# Altium schematic sheet Lipo-Charger-Sch.SchDoc
size A4; SheetNumber: 1; SheetTotal: 1
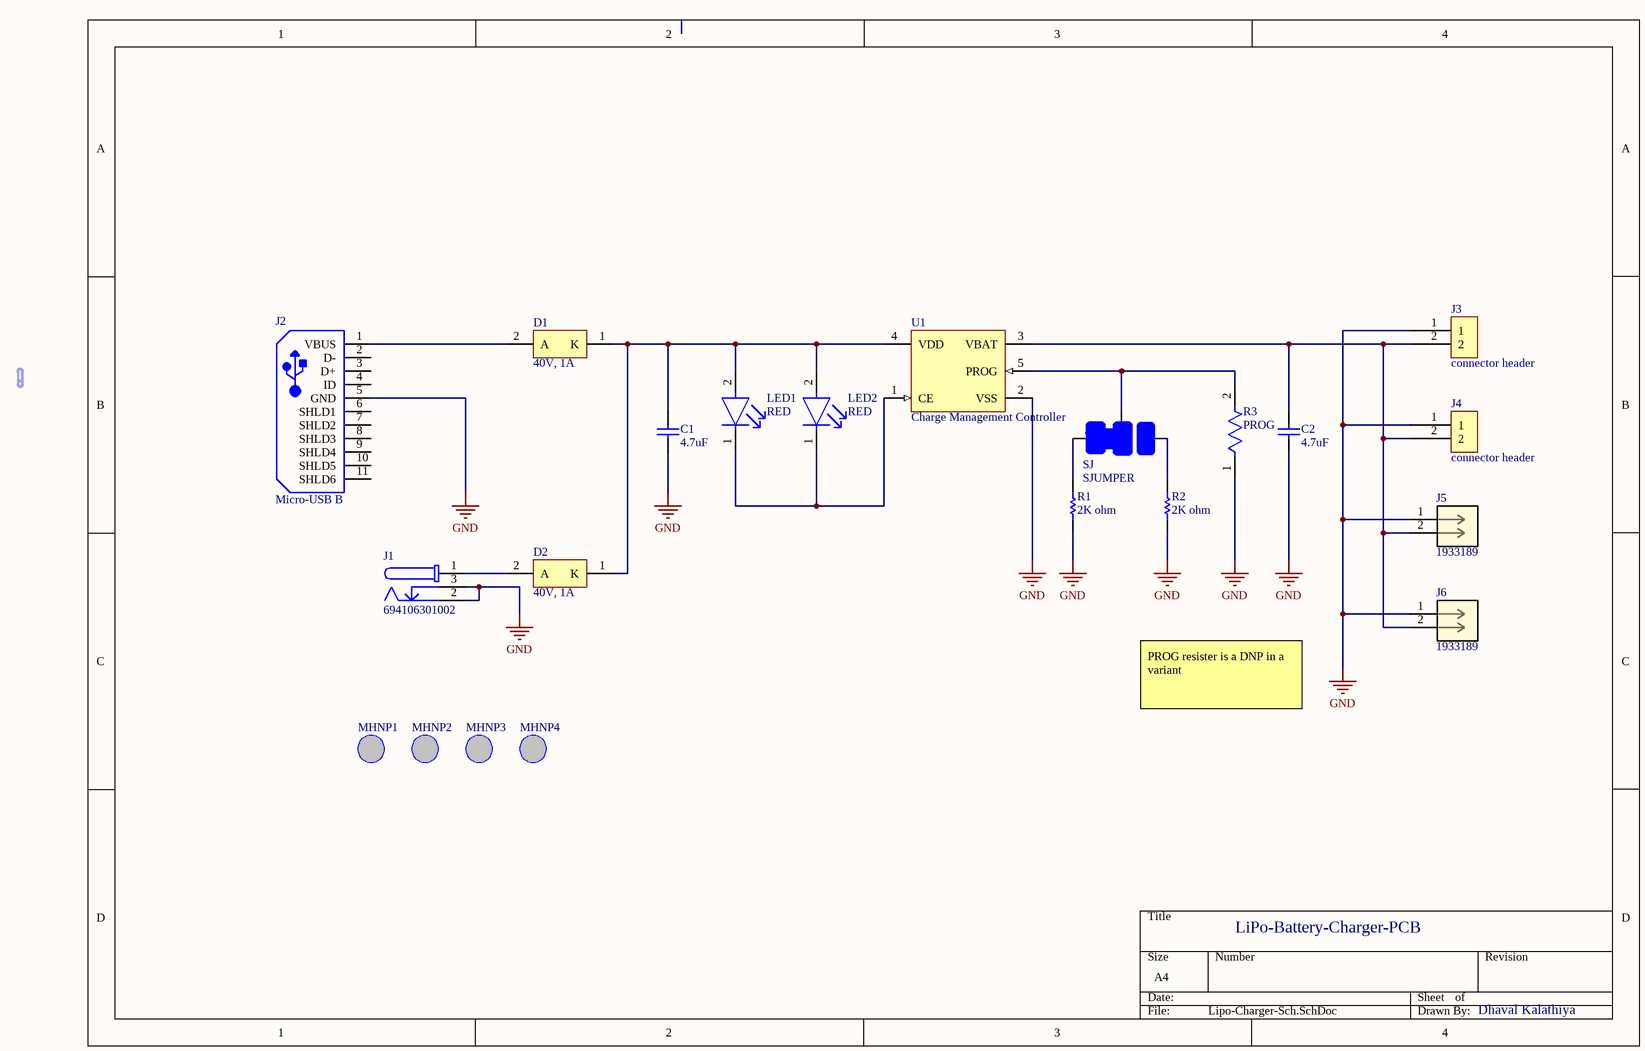
[diagram p0: Lipo-Charger-Sch.SchDoc]

## Parts
C1  4.7uF  [CAPC1206(3216)150_M]
C2  4.7uF  [CAPC1206(3216)150_M]
D1  40V, 1A  [ONSC-SMA-2-403D-02_V]
D2  40V, 1A  [ONSC-SMA-2-403D-02_V]
J1  694106301002  [694106301002]
J2  Micro-USB B  [USB-MICRO-B_V]
J3  connector header  [2-179276-2]
J4  connector header  [2-179276-2]
J5  1933189  [CONN02_1933189_PXC]
J6  1933189  [CONN02_1933189_PXC]
LED1  RED  [FP-SML-LX0603IW-TR-MFG]
LED2  RED  [FP-SML-LX0603IW-TR-MFG]
MHNP1  Mounting Hole Non-Plated 3.2mm  [MTHNP3P2]  (value not drawn)
MHNP2  Mounting Hole Non-Plated 3.2mm  [MTHNP3P2]  (value not drawn)
MHNP3  Mounting Hole Non-Plated 3.2mm  [MTHNP3P2]  (value not drawn)
MHNP4  Mounting Hole Non-Plated 3.2mm  [MTHNP3P2]  (value not drawn)
R1  2K ohm  [RESC2013X70X40LL20T20]
R2  2K ohm  [RESC2013X70X40LL20T20]
R3  PROG  [FP-CMF50-0]
SJ  SJUMPER  [SJUMPER-Footprint-1]
U1  Charge Management Controller  [SOT-23-OT5_M]

## Nets
GND: C1.1 C2.1 J1.2 J1.3 J2.5(GND) J3.1 J4.1 J5.1 J6.1 R1.1 R2.1 R3.1 U1.2(VSS)
NetC1_2: C1.2 D1.1(K) D2.1(K) LED1.2(A) LED2.2(A) U1.4(VDD)
NetC2_2: C2.2 J3.2 J4.2 J5.2 J6.2 U1.3(VBAT)
NetD1_2: D1.2(A) J2.1(VBUS)
NetD2_2: D2.2(A) J1.1
NetLED1_1: LED1.1(C) LED2.1(C) U1.1(CE)
NetR1_2: R1.2 SJ.1
NetR2_2: R2.2 SJ.3
NetR3_2: R3.2 SJ.2 U1.5(PROG)

Not connected (* = marked no-connect by the designer): J2 2(D-) 3(D+) 4(ID) 6(SHLD1) 7(SHLD2) 8(SHLD3) 9(SHLD4) 10(SHLD5) 11(SHLD6)

## Notes on the sheet
- PROG resister is a DNP in a variant
- LiPo-Battery-Charger-PCB
- Dhaval Kalathiya

## Library data of the parts
C1 C2 = CMP-1037-04894-1: Case-EIA: 1206; Rated Voltage: 6.3 V; Tolerance: Â±5%; Case-Metric: 3216; Value: 4.7uF; Technology: SMT; Max Thickness: 1.45 mm
D1 D2 = CMP-1055-00320-1: Schottky Power Rectifier, 2-Pin SMA, Pb-Free, Tape and Reel; PartNumber: MBRA140T3G; Manufacturer: On Semiconductor; Configuration: Single; IFSM Max (A): 30; PackageReference: SMA-2-403D-02; PackageDescription: 2-Pin Small Molded Package, J-Bend Lead, Body 2.605 x 4.315 mm; RoHS: TRUE; ComponentLink1Description: Manufacturer URL; Packing: Tape and Reel; ComponentLink3URL: http://www.onsemi.com/pub_link/Collateral/403D-02.PDF; ComponentLink2Description: Datasheet; ComponentLink2URL: http://www.onsemi.cn/pub_link/Collateral/MBRA140T3-D.PDF; DatasheetVersion: Rev. 10; ComponentLink1URL: http://www.onsemi.com/; ComponentLink3Description: Package Specification; Mounting Technology: Surface Mount; PackageVersion: Rev. G, 07/2012
J1 = CMP-1502-00188-2: NexarPartId: 52676100; Voltage Rating (DC): 20V; Gender: Male; Voltage Rating: 24V; Connector Type: Power; Insulation Resistance: 100MΩ; Current Rating: 5A; Shielding: Unshielded; Number of Contacts: 3; Color: Black; Housing Material: Polyamide; Contact Gender: Female; REACH SVHC: Unknown; Termination: Through Hole; Height: 11mm; RoHS: Compliant; Mount: Through Hole; Flammability Rating: UL94 V-0; Packaging: Bulk; Min Operating Temperature: -40°C; Contact Plating: Tin; Max Operating Temperature: 85°C; Operating Supply Voltage: 24V; Contact Material: Gold, Tin
J2 = CMP-2000-05827-1: Manufacturer: Molex; Featured Product: Micro-USBConnectorsUSBConnectors; Other Names: WM1399DKR; Package Version: Rev. F, 12/2012; Number of Contacts: 5; Connector Type: USB-microB; Catalog Drawings: 1050170001; 3D Model: 105017-0001.stp; Mating Products: WM17145-ND-CABLEMICROUSBBTOSTDA1.0MWM17147-ND-CABLEMICROUSBBTOSTDA2.0MWM17146-ND-CABLEMICROUSBBTOSTDA1.5M; PCN Assembly/Origin: ResinSupplier21/Oct/2015; Voltage - Max: 30V; Online Catalog: Molex-MicroUSB; Gender: Receptacle; Manufacturer URL: http://www.molex.com/; Package Description: 5-Leads USB, Micro B, Body 7.5 x 5 mm, Pitch 0.65 mm; Datasheet URL: http://www.molex.com/elqNow/elqRedir.htm?ref=http://www.molex.com/webdocs/datasheets/pdf/en-us/1050170001_IO_CONNECTORS.pdf; Ingress Protection: -; Datasheet Version: 03/2016; Mounting Type: BoardCutout,SurfaceMount,RightAngle; Circuits: 5; Standard Package: 1; Package Reference: MICRO-B; Package URL: http://www.molex.com/pdm_docs/sd/1050170001_sd.pdf; Category: Connectors,Interconnects; Series: -; RoHS Information: 1050170001CertofCompliance; Features: Shielded,SolderRetention; Family: USB,DVI,HDMIConnectors; Specifications: -; Packaging: Digi-Reel®; Mounting Technology: SurfaceMount
J3 J4 = 2-179276-2: Manufacture: TE; Supplier 1: Digikey; Supplier Part Number 1: A29548-ND; Manufacture part number: 2-179276-2
J5 J6 = 1933189: No Description Available; Mfr_Name: Phoenix Contact; RefDes: RefDes; Type: Type; ComponentLink1Description: New link; ComponentLink1URL: https://www.digikey.de/en/products/detail/phoenix-contact/1933189/568682
LED1 LED2 = CMP-57192-000012-1: LED RED DIFFUSED SMD; Luminous Intensity: 14mcd; Test Current: 20mA; Viewing Angle: 160°; Approvals: UL; Forward Voltage: 2V; Power Dissipation: 50mW; Dominant Wavelength: 635nm; Number of LEDs: 1; Lens Color: White; Height: 0.6mm; RoHS Compliant: Yes; Lead Free: Lead Free; Number of Pins: 2; Packaging: Tape and Reel; Case/Package: 0603; Length: 1.6mm; Color: Red; Max Operating Temperature: 85°C; Illumination Color: Red; Case Code (Metric): 1608; Diameter: 0.061inch; Min Operating Temperature: -25°C; Lens Style: Diffused; Mount: Surface Mount; Width: 0.8mm; Case Code (Imperial): 0603; Lens Transparency: Diffused; Wavelength: 635nm; Package Quantity: 1; Forward Current: 20mA
MHNP1-MHNP4 = MTHNP3P2
R1 R2 = CMP-2001-00483-1: Part Number: ERJ-P06J202V; Manufacturer: Panasonic
R3 = CMP-00030-44386654-1: Tolerance: 1%; Max Power Dissipation: 250mW; Voltage Rating: 200V; Power Rating: 125mW; Temperature Coefficient: 50ppm/°C; Resistance: 73.2kΩ; Width: 1.65mm; Length: 3.81mm; Schedule B: 8533210090, 8533210090; Termination: Axial; Lead Free: Lead Free; Diameter: 1.65mm; Voltage Rating (DC): 200V; NexarPartId: 44386654; Packaging: Cut Tape; Max Operating Temperature: 175°C; Composition: Metal Film; RoHS: Compliant; Mount: Through Hole; Features: Flame Retardant Coating, Moisture Resistant; Number of Terminations: 2; Min Operating Temperature: -55°C; Case/Package: Axial
SJ = CMP-00000-1: solder jumper 3 pods and pins; Pins: 3
U1 = CMP-0133-00139-1: Code_IPC: SOT23-5; PackageDescription: 5-Lead Plastic Small Outline Transistor (OT) [SOT-23]; PackageVersion: revBB, Aug-2009; DatasheetVersion: revB, Sep-2007; PackageReference: SOT-23-OT5